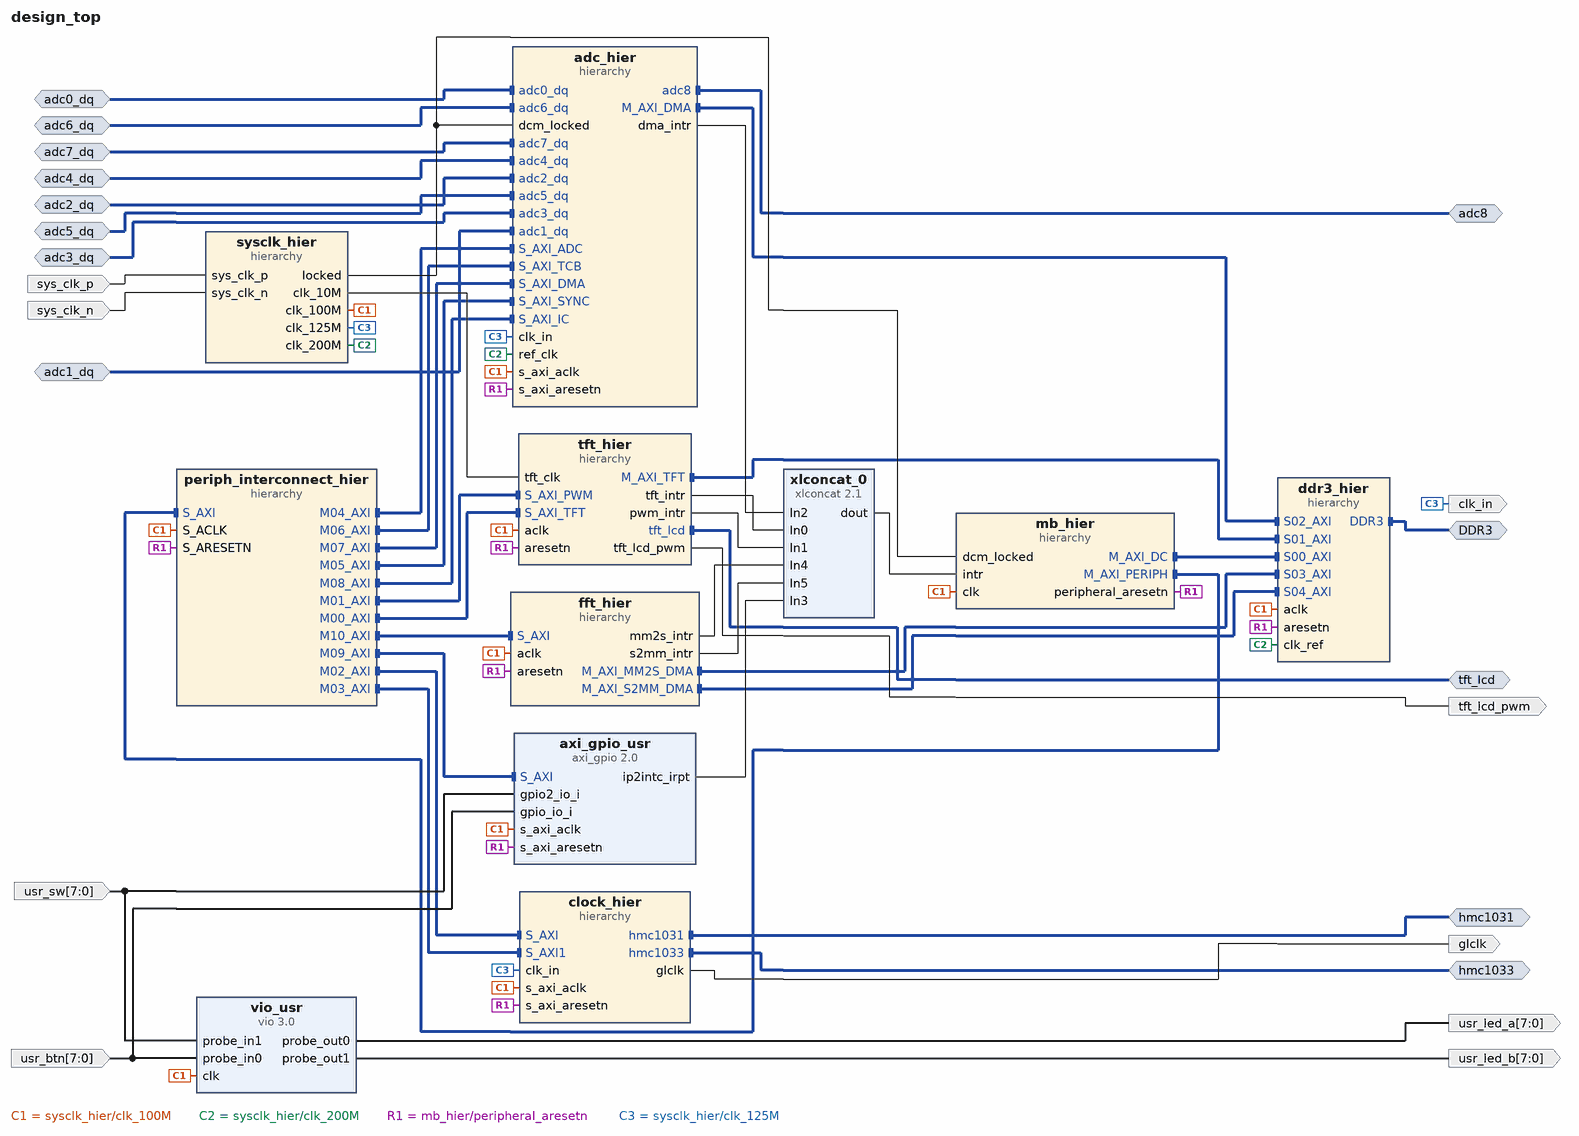
[diagram p0: block diagram of the top level]
# Vivado block design design_top, xc7a200tffg1156-2, Vivado 2018.3
create_bd_design design_top

create_bd_intf_port -mode Master -vlnv xilinx.com:interface:ddrx_rtl:1.0 DDR3
create_bd_intf_port -mode Master -vlnv xilinx.com:interface:vga_rtl:1.0 tft_lcd
create_bd_intf_port -mode Master -vlnv milandr.ru:interface:hmc1031_rtl:1.0 hmc1031
create_bd_intf_port -mode Master -vlnv milandr.ru:interface:hmc1033_io_rtl:1.0 hmc1033
create_bd_intf_port -mode Master -vlnv milandr.ru:interface:adc8_intf_rtl:1.0 adc8
create_bd_intf_port -mode Slave -vlnv milandr.ru:interface:adc8_dq_intf_rtl:1.0 adc0_dq
create_bd_intf_port -mode Slave -vlnv milandr.ru:interface:adc8_dq_intf_rtl:1.0 adc1_dq
create_bd_intf_port -mode Slave -vlnv milandr.ru:interface:adc8_dq_intf_rtl:1.0 adc2_dq
create_bd_intf_port -mode Slave -vlnv milandr.ru:interface:adc8_dq_intf_rtl:1.0 adc3_dq
create_bd_intf_port -mode Slave -vlnv milandr.ru:interface:adc8_dq_intf_rtl:1.0 adc4_dq
create_bd_intf_port -mode Slave -vlnv milandr.ru:interface:adc8_dq_intf_rtl:1.0 adc5_dq
create_bd_intf_port -mode Slave -vlnv milandr.ru:interface:adc8_dq_intf_rtl:1.0 adc6_dq
create_bd_intf_port -mode Slave -vlnv milandr.ru:interface:adc8_dq_intf_rtl:1.0 adc7_dq
create_bd_port -dir I -type clk sys_clk_p
set_property -dict {CONFIG.FREQ_HZ 125000000} [get_bd_ports sys_clk_p]
create_bd_port -dir I -type clk sys_clk_n
set_property -dict {CONFIG.FREQ_HZ 125000000} [get_bd_ports sys_clk_n]
create_bd_port -dir O tft_lcd_pwm
create_bd_port -dir I -from 7 -to 0 usr_btn
create_bd_port -dir I -from 7 -to 0 usr_sw
create_bd_port -dir O -type clk glclk
set_property -dict {CONFIG.FREQ_HZ 5000000} [get_bd_ports glclk]
create_bd_port -dir O clk_in
create_bd_port -dir O -from 7 -to 0 usr_led_a
create_bd_port -dir O -from 7 -to 0 usr_led_b

create_bd_cell -type hier ddr3_hier
create_bd_cell -type hier mb_hier
create_bd_cell -type hier sysclk_hier
create_bd_cell -type ip -vlnv xilinx.com:ip:xlconcat:2.1 xlconcat_0
set_property -dict {CONFIG.NUM_PORTS 6} [get_bd_cells xlconcat_0]
create_bd_cell -type hier periph_interconnect_hier
create_bd_cell -type hier tft_hier
create_bd_cell -type ip -vlnv xilinx.com:ip:vio:3.0 vio_usr
set_property -dict [list \
  CONFIG.C_NUM_PROBE_IN 2 \
  CONFIG.C_NUM_PROBE_OUT 2 \
  CONFIG.C_PROBE_OUT0_INIT_VAL 0xFF \
  CONFIG.C_PROBE_OUT0_WIDTH 8 \
  CONFIG.C_PROBE_OUT1_INIT_VAL 0xFF \
  CONFIG.C_PROBE_OUT1_WIDTH 8 \
] [get_bd_cells vio_usr]
create_bd_cell -type hier clock_hier
create_bd_cell -type hier adc_hier
create_bd_cell -type ip -vlnv xilinx.com:ip:axi_gpio:2.0 axi_gpio_usr
set_property -dict [list \
  CONFIG.C_ALL_INPUTS 1 \
  CONFIG.C_ALL_INPUTS_2 1 \
  CONFIG.C_GPIO2_WIDTH 8 \
  CONFIG.C_GPIO_WIDTH 8 \
  CONFIG.C_INTERRUPT_PRESENT 1 \
  CONFIG.C_IS_DUAL 1 \
] [get_bd_cells axi_gpio_usr]
create_bd_cell -type hier fft_hier

# ---- hierarchy /ddr3_hier ----
current_bd_instance /ddr3_hier
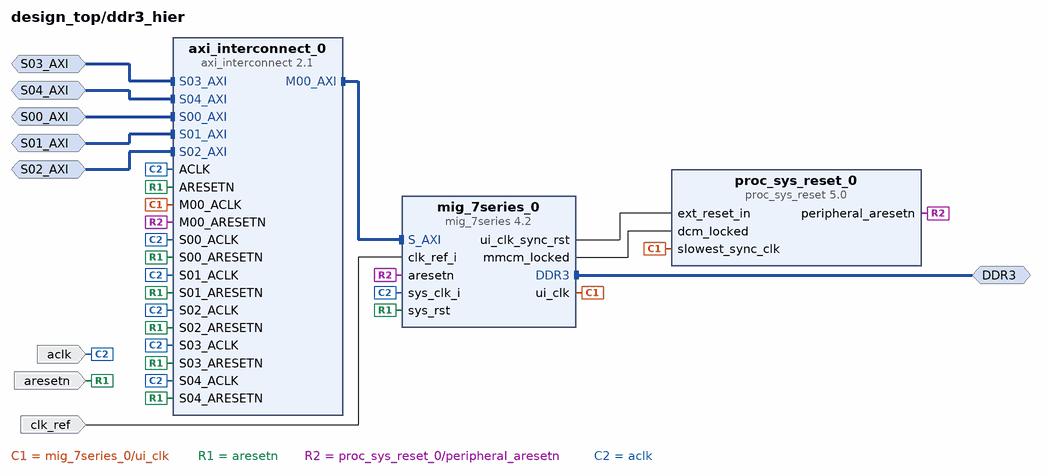
[diagram p1: block diagram inside /ddr3_hier]
create_bd_intf_pin -mode Master -vlnv xilinx.com:interface:ddrx_rtl:1.0 DDR3
create_bd_intf_pin -mode Slave -vlnv xilinx.com:interface:aximm_rtl:1.0 S00_AXI
create_bd_intf_pin -mode Slave -vlnv xilinx.com:interface:aximm_rtl:1.0 S01_AXI
create_bd_intf_pin -mode Slave -vlnv xilinx.com:interface:aximm_rtl:1.0 S02_AXI
create_bd_intf_pin -mode Slave -vlnv xilinx.com:interface:aximm_rtl:1.0 S03_AXI
create_bd_intf_pin -mode Slave -vlnv xilinx.com:interface:aximm_rtl:1.0 S04_AXI
create_bd_pin -dir I -type clk clk_ref
create_bd_pin -dir I -type rst aresetn
create_bd_pin -dir I -type clk aclk

create_bd_cell -type ip -vlnv xilinx.com:ip:proc_sys_reset:5.0 proc_sys_reset_0
create_bd_cell -type ip -vlnv xilinx.com:ip:mig_7series:4.2 mig_7series_0
set_property -dict [list \
  CONFIG.BOARD_MIG_PARAM Custom \
  CONFIG.RESET_BOARD_INTERFACE Custom \
  CONFIG.XML_INPUT_FILE mig_b.prj \
] [get_bd_cells mig_7series_0]
create_bd_cell -type ip -vlnv xilinx.com:ip:axi_interconnect:2.1 axi_interconnect_0
set_property -dict [list \
  CONFIG.ENABLE_ADVANCED_OPTIONS 1 \
  CONFIG.M00_HAS_DATA_FIFO 2 \
  CONFIG.M00_HAS_REGSLICE 3 \
  CONFIG.NUM_MI 1 \
  CONFIG.NUM_SI 5 \
  CONFIG.S00_ARB_PRIORITY 1 \
  CONFIG.S00_HAS_DATA_FIFO 2 \
  CONFIG.S00_HAS_REGSLICE 3 \
  CONFIG.S01_ARB_PRIORITY 2 \
  CONFIG.S01_HAS_DATA_FIFO 2 \
  CONFIG.S01_HAS_REGSLICE 3 \
  CONFIG.S02_HAS_DATA_FIFO 2 \
  CONFIG.S02_HAS_REGSLICE 3 \
  CONFIG.S03_HAS_DATA_FIFO 2 \
  CONFIG.S04_HAS_DATA_FIFO 2 \
  CONFIG.STRATEGY 2 \
] [get_bd_cells axi_interconnect_0]

# ---- hierarchy /mb_hier ----
current_bd_instance /mb_hier
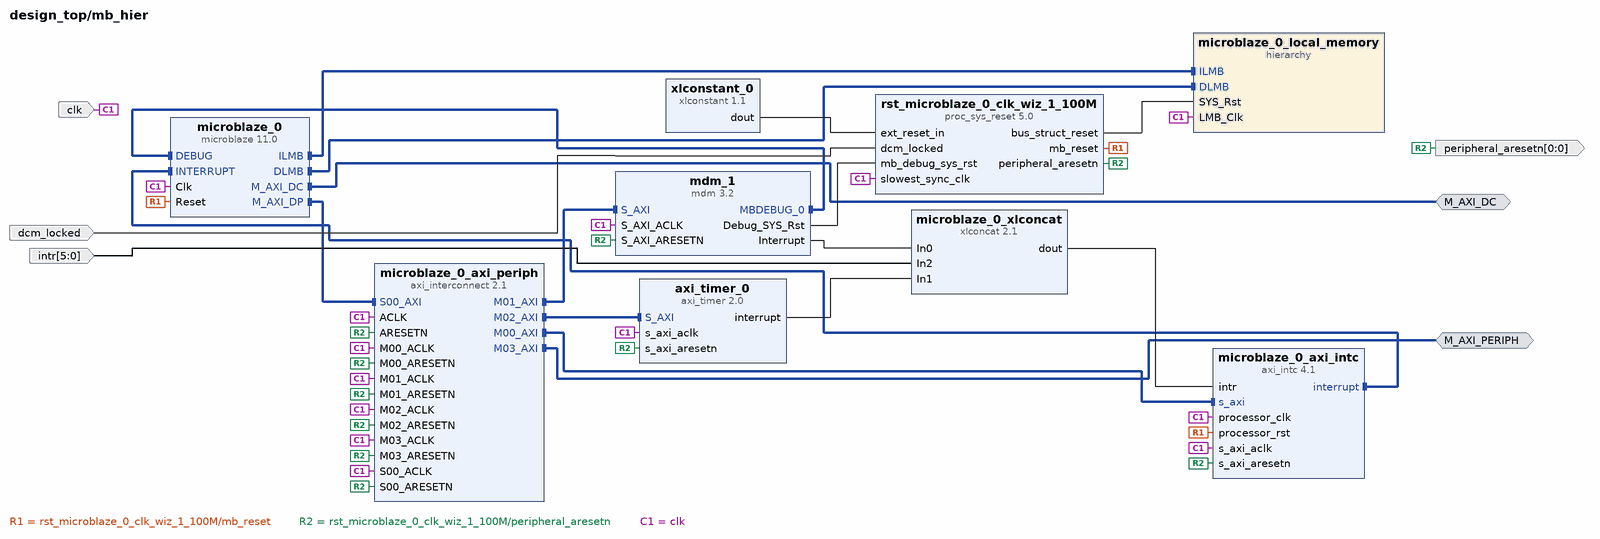
[diagram p2: block diagram inside /mb_hier]
create_bd_intf_pin -mode Master -vlnv xilinx.com:interface:aximm_rtl:1.0 M_AXI_DC
create_bd_intf_pin -mode Master -vlnv xilinx.com:interface:aximm_rtl:1.0 M_AXI_PERIPH
create_bd_pin -dir I -type clk clk
create_bd_pin -dir I dcm_locked
create_bd_pin -dir O -from 0 -to 0 -type rst peripheral_aresetn
create_bd_pin -dir I -from 5 -to 0 intr

create_bd_cell -type ip -vlnv xilinx.com:ip:proc_sys_reset:5.0 rst_microblaze_0_clk_wiz_1_100M
create_bd_cell -type ip -vlnv xilinx.com:ip:mdm:3.2 mdm_1
set_property -dict {CONFIG.C_ADDR_SIZE 32 CONFIG.C_M_AXI_ADDR_WIDTH 32 CONFIG.C_USE_UART 1} [get_bd_cells mdm_1]
create_bd_cell -type ip -vlnv xilinx.com:ip:xlconcat:2.1 microblaze_0_xlconcat
set_property -dict {CONFIG.NUM_PORTS 3} [get_bd_cells microblaze_0_xlconcat]
create_bd_cell -type ip -vlnv xilinx.com:ip:microblaze:11.0 microblaze_0
set_property -dict [list \
  CONFIG.C_ADDR_TAG_BITS 0 \
  CONFIG.C_BRANCH_TARGET_CACHE_SIZE 0 \
  CONFIG.C_DCACHE_BYTE_SIZE 8192 \
  CONFIG.C_DEBUG_ENABLED 1 \
  CONFIG.C_D_AXI 1 \
  CONFIG.C_D_LMB 1 \
  CONFIG.C_I_LMB 1 \
  CONFIG.C_USE_BARREL 1 \
  CONFIG.C_USE_BRANCH_TARGET_CACHE 1 \
  CONFIG.C_USE_DCACHE 1 \
  CONFIG.C_USE_DIV 1 \
  CONFIG.C_USE_FPU 2 \
  CONFIG.C_USE_HW_MUL 1 \
  CONFIG.C_USE_ICACHE 0 \
  CONFIG.C_USE_MSR_INSTR 1 \
  CONFIG.C_USE_PCMP_INSTR 1 \
] [get_bd_cells microblaze_0]
create_bd_cell -type ip -vlnv xilinx.com:ip:axi_intc:4.1 microblaze_0_axi_intc
set_property -dict {CONFIG.C_HAS_FAST 1} [get_bd_cells microblaze_0_axi_intc]
create_bd_cell -type ip -vlnv xilinx.com:ip:axi_interconnect:2.1 microblaze_0_axi_periph
set_property -dict {CONFIG.NUM_MI 4} [get_bd_cells microblaze_0_axi_periph]
create_bd_cell -type hier microblaze_0_local_memory
create_bd_cell -type ip -vlnv xilinx.com:ip:axi_timer:2.0 axi_timer_0
create_bd_cell -type ip -vlnv xilinx.com:ip:xlconstant:1.1 xlconstant_0

# ---- hierarchy /mb_hier/microblaze_0_local_memory ----
current_bd_instance /mb_hier/microblaze_0_local_memory
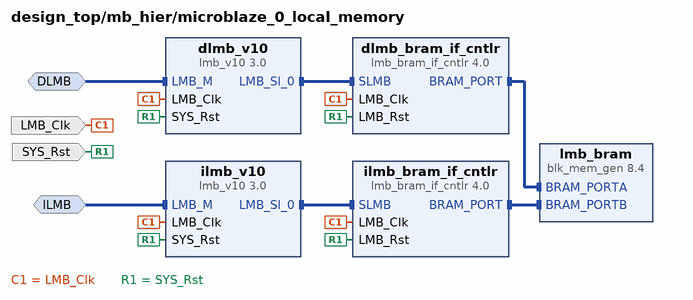
[diagram p3: block diagram inside /mb_hier/microblaze_0_local_memory]
create_bd_intf_pin -mode MirroredMaster -vlnv xilinx.com:interface:lmb_rtl:1.0 DLMB
create_bd_intf_pin -mode MirroredMaster -vlnv xilinx.com:interface:lmb_rtl:1.0 ILMB
create_bd_pin -dir I -type clk LMB_Clk
create_bd_pin -dir I -type rst SYS_Rst

create_bd_cell -type ip -vlnv xilinx.com:ip:lmb_v10:3.0 dlmb_v10
create_bd_cell -type ip -vlnv xilinx.com:ip:lmb_v10:3.0 ilmb_v10
create_bd_cell -type ip -vlnv xilinx.com:ip:lmb_bram_if_cntlr:4.0 dlmb_bram_if_cntlr
set_property -dict {CONFIG.C_ECC 0} [get_bd_cells dlmb_bram_if_cntlr]
create_bd_cell -type ip -vlnv xilinx.com:ip:lmb_bram_if_cntlr:4.0 ilmb_bram_if_cntlr
set_property -dict {CONFIG.C_ECC 0} [get_bd_cells ilmb_bram_if_cntlr]
create_bd_cell -type ip -vlnv xilinx.com:ip:blk_mem_gen:8.4 lmb_bram
set_property -dict {CONFIG.Memory_Type True_Dual_Port_RAM CONFIG.use_bram_block BRAM_Controller} [get_bd_cells lmb_bram]

# ---- hierarchy /sysclk_hier ----
current_bd_instance /sysclk_hier
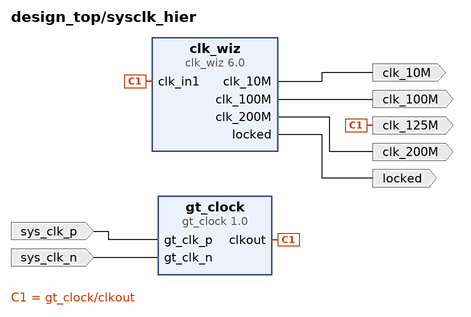
[diagram p4: block diagram inside /sysclk_hier]
create_bd_pin -dir I -type clk sys_clk_p
create_bd_pin -dir I -type clk sys_clk_n
create_bd_pin -dir O locked
create_bd_pin -dir O -type clk clk_100M
create_bd_pin -dir O -type clk clk_200M
create_bd_pin -dir O -type clk clk_10M
create_bd_pin -dir O clk_125M

create_bd_cell -type ip -vlnv milandr.ru:ip:gt_clock:1.0 gt_clock
create_bd_cell -type ip -vlnv xilinx.com:ip:clk_wiz:6.0 clk_wiz
set_property -dict [list \
  CONFIG.CLKIN1_JITTER_PS 80.0 \
  CONFIG.CLKOUT1_JITTER 124.615 \
  CONFIG.CLKOUT1_PHASE_ERROR 96.948 \
  CONFIG.CLKOUT2_JITTER 109.241 \
  CONFIG.CLKOUT2_PHASE_ERROR 96.948 \
  CONFIG.CLKOUT2_REQUESTED_OUT_FREQ 200.000 \
  CONFIG.CLKOUT2_USED true \
  CONFIG.CLKOUT3_JITTER 197.700 \
  CONFIG.CLKOUT3_PHASE_ERROR 96.948 \
  CONFIG.CLKOUT3_REQUESTED_OUT_FREQ 10.000 \
  CONFIG.CLKOUT3_USED true \
  CONFIG.CLKOUT4_JITTER 124.615 \
  CONFIG.CLKOUT4_PHASE_ERROR 96.948 \
  CONFIG.CLKOUT4_REQUESTED_OUT_FREQ 25.000 \
  CONFIG.CLKOUT4_USED false \
  CONFIG.CLK_OUT1_PORT clk_100M \
  CONFIG.CLK_OUT2_PORT clk_200M \
  CONFIG.CLK_OUT3_PORT clk_10M \
  CONFIG.CLK_OUT4_PORT clk_25M \
  CONFIG.MMCM_CLKFBOUT_MULT_F 8.000 \
  CONFIG.MMCM_CLKIN1_PERIOD 8.000 \
  CONFIG.MMCM_CLKOUT0_DIVIDE_F 10.000 \
  CONFIG.MMCM_CLKOUT1_DIVIDE 5 \
  CONFIG.MMCM_CLKOUT2_DIVIDE 100 \
  CONFIG.MMCM_CLKOUT3_DIVIDE 1 \
  CONFIG.MMCM_DIVCLK_DIVIDE 1 \
  CONFIG.NUM_OUT_CLKS 3 \
  CONFIG.PRIM_IN_FREQ 125 \
  CONFIG.PRIM_SOURCE Global_buffer \
  CONFIG.USE_RESET false \
] [get_bd_cells clk_wiz]

# ---- hierarchy /periph_interconnect_hier ----
current_bd_instance /periph_interconnect_hier
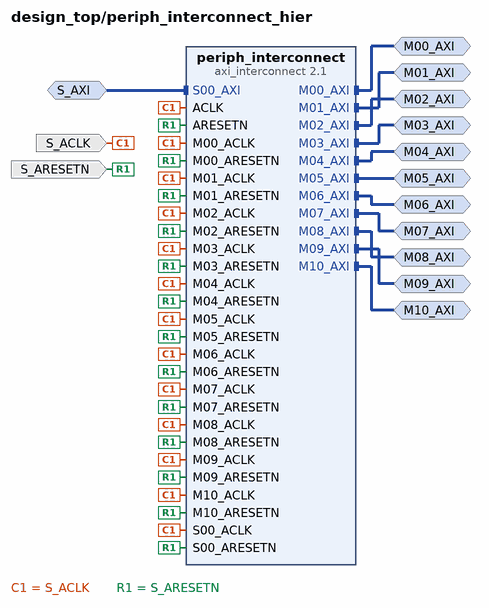
[diagram p5: block diagram inside /periph_interconnect_hier]
create_bd_intf_pin -mode Slave -vlnv xilinx.com:interface:aximm_rtl:1.0 S_AXI
create_bd_intf_pin -mode Master -vlnv xilinx.com:interface:aximm_rtl:1.0 M00_AXI
create_bd_intf_pin -mode Master -vlnv xilinx.com:interface:aximm_rtl:1.0 M01_AXI
create_bd_intf_pin -mode Master -vlnv xilinx.com:interface:aximm_rtl:1.0 M02_AXI
create_bd_intf_pin -mode Master -vlnv xilinx.com:interface:aximm_rtl:1.0 M03_AXI
create_bd_intf_pin -mode Master -vlnv xilinx.com:interface:aximm_rtl:1.0 M04_AXI
create_bd_intf_pin -mode Master -vlnv xilinx.com:interface:aximm_rtl:1.0 M05_AXI
create_bd_intf_pin -mode Master -vlnv xilinx.com:interface:aximm_rtl:1.0 M06_AXI
create_bd_intf_pin -mode Master -vlnv xilinx.com:interface:aximm_rtl:1.0 M07_AXI
create_bd_intf_pin -mode Master -vlnv xilinx.com:interface:aximm_rtl:1.0 M08_AXI
create_bd_intf_pin -mode Master -vlnv xilinx.com:interface:aximm_rtl:1.0 M09_AXI
create_bd_intf_pin -mode Master -vlnv xilinx.com:interface:aximm_rtl:1.0 M10_AXI
create_bd_pin -dir I -type clk S_ACLK
create_bd_pin -dir I -type rst S_ARESETN

create_bd_cell -type ip -vlnv xilinx.com:ip:axi_interconnect:2.1 periph_interconnect
set_property -dict {CONFIG.NUM_MI 11} [get_bd_cells periph_interconnect]

# ---- hierarchy /tft_hier ----
current_bd_instance /tft_hier
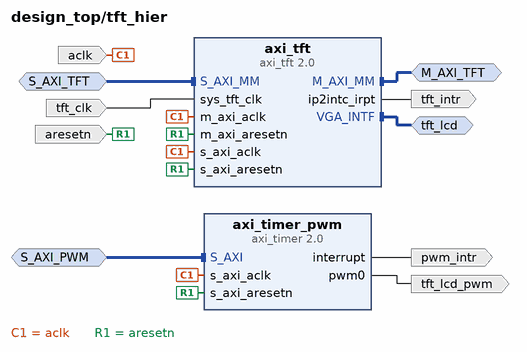
[diagram p6: block diagram inside /tft_hier]
create_bd_intf_pin -mode Slave -vlnv xilinx.com:interface:aximm_rtl:1.0 S_AXI_TFT
create_bd_intf_pin -mode Master -vlnv xilinx.com:interface:aximm_rtl:1.0 M_AXI_TFT
create_bd_intf_pin -mode Master -vlnv xilinx.com:interface:vga_rtl:1.0 tft_lcd
create_bd_intf_pin -mode Slave -vlnv xilinx.com:interface:aximm_rtl:1.0 S_AXI_PWM
create_bd_pin -dir I -type clk aclk
create_bd_pin -dir I -type rst aresetn
create_bd_pin -dir O -type intr tft_intr
create_bd_pin -dir I -type clk tft_clk
create_bd_pin -dir O tft_lcd_pwm
create_bd_pin -dir O -type intr pwm_intr

create_bd_cell -type ip -vlnv xilinx.com:ip:axi_tft:2.0 axi_tft
set_property -dict {CONFIG.C_EN_I2C_INTF 0 CONFIG.C_M_AXI_DATA_WIDTH 32 CONFIG.C_TFT_INTERFACE 0} [get_bd_cells axi_tft]
create_bd_cell -type ip -vlnv xilinx.com:ip:axi_timer:2.0 axi_timer_pwm

# ---- hierarchy /clock_hier ----
current_bd_instance /clock_hier
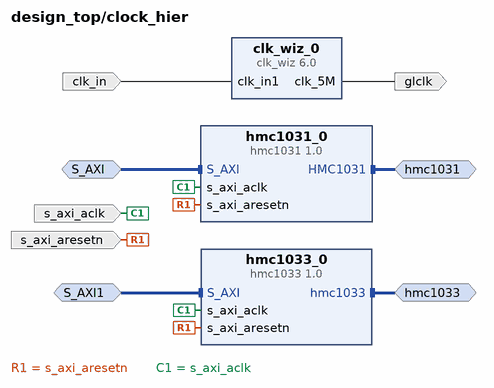
[diagram p7: block diagram inside /clock_hier]
create_bd_intf_pin -mode Slave -vlnv xilinx.com:interface:aximm_rtl:1.0 S_AXI
create_bd_intf_pin -mode Master -vlnv milandr.ru:interface:hmc1031_rtl:1.0 hmc1031
create_bd_intf_pin -mode Slave -vlnv xilinx.com:interface:aximm_rtl:1.0 S_AXI1
create_bd_intf_pin -mode Master -vlnv milandr.ru:interface:hmc1033_io_rtl:1.0 hmc1033
create_bd_pin -dir I -type clk s_axi_aclk
create_bd_pin -dir I -type rst s_axi_aresetn
create_bd_pin -dir O -type clk glclk
create_bd_pin -dir I -type clk clk_in

create_bd_cell -type ip -vlnv milandr.ru:ip:hmc1031:1.0 hmc1031_0
create_bd_cell -type ip -vlnv xilinx.com:ip:clk_wiz:6.0 clk_wiz_0
set_property -dict [list \
  CONFIG.CLKIN1_JITTER_PS 80.0 \
  CONFIG.CLKOUT1_JITTER 229.502 \
  CONFIG.CLKOUT1_PHASE_ERROR 115.818 \
  CONFIG.CLKOUT1_REQUESTED_OUT_FREQ 5.000 \
  CONFIG.CLK_OUT1_PORT clk_5M \
  CONFIG.JITTER_SEL Min_O_Jitter \
  CONFIG.MMCM_BANDWIDTH HIGH \
  CONFIG.MMCM_CLKFBOUT_MULT_F 4.875 \
  CONFIG.MMCM_CLKIN1_PERIOD 8.000 \
  CONFIG.MMCM_CLKIN2_PERIOD 10.0 \
  CONFIG.MMCM_CLKOUT0_DIVIDE_F 121.875 \
  CONFIG.MMCM_DIVCLK_DIVIDE 1 \
  CONFIG.PRIM_IN_FREQ 125.000 \
  CONFIG.PRIM_SOURCE Global_buffer \
  CONFIG.USE_LOCKED false \
  CONFIG.USE_RESET false \
] [get_bd_cells clk_wiz_0]
create_bd_cell -type ip -vlnv milandr.ru:ip:hmc1033:1.0 hmc1033_0

# ---- hierarchy /adc_hier ----
current_bd_instance /adc_hier
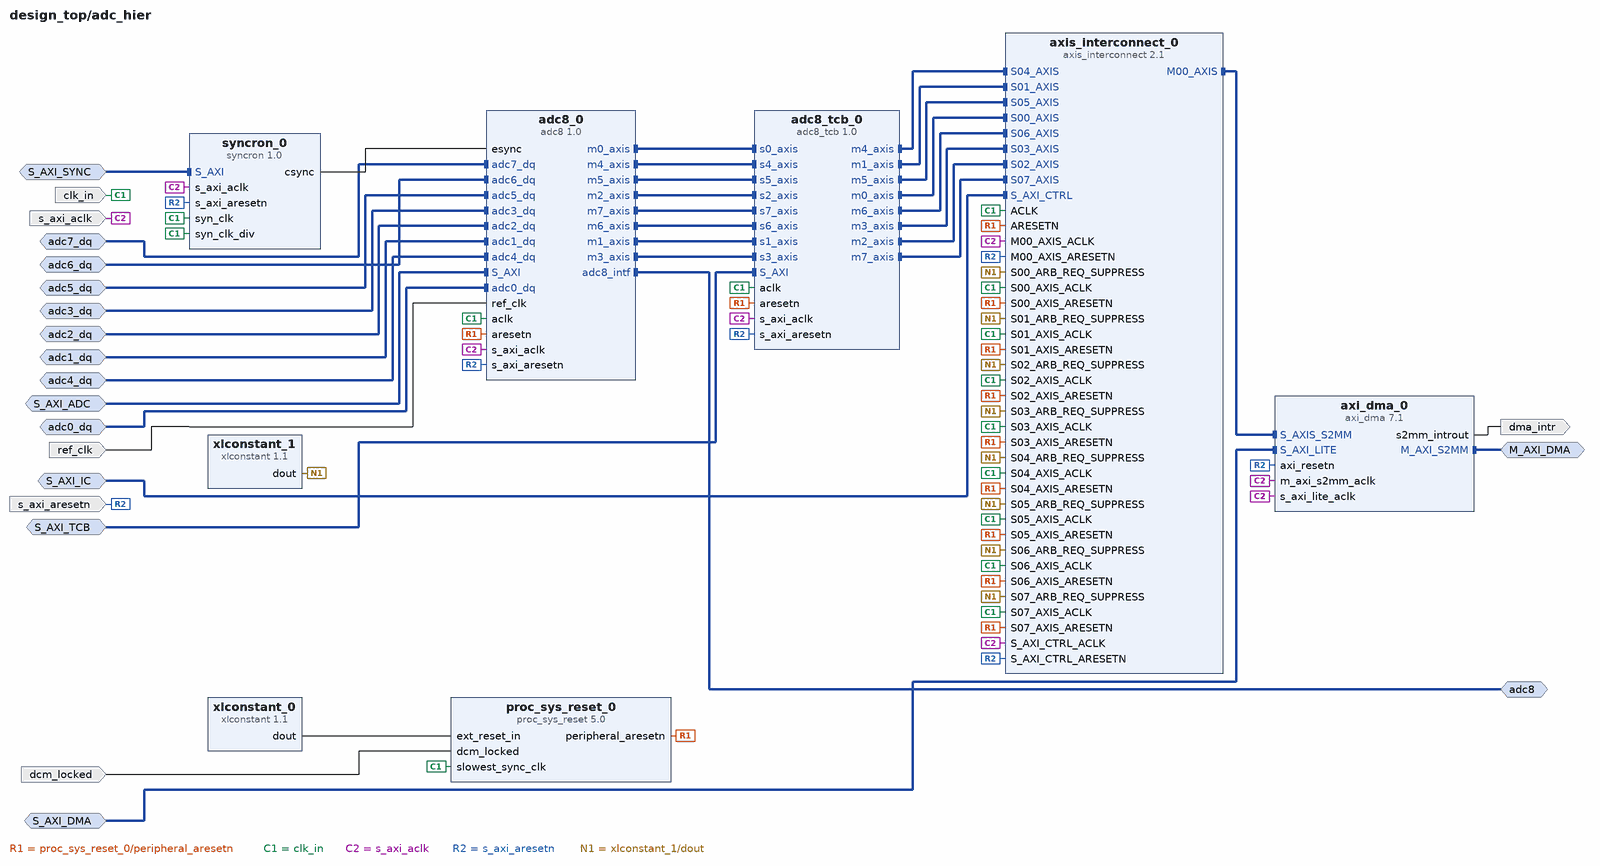
[diagram p8: block diagram inside /adc_hier]
create_bd_intf_pin -mode Slave -vlnv xilinx.com:interface:aximm_rtl:1.0 S_AXI_SYNC
create_bd_intf_pin -mode Slave -vlnv xilinx.com:interface:aximm_rtl:1.0 S_AXI_ADC
create_bd_intf_pin -mode Master -vlnv milandr.ru:interface:adc8_intf_rtl:1.0 adc8
create_bd_intf_pin -mode Slave -vlnv milandr.ru:interface:adc8_dq_intf_rtl:1.0 adc0_dq
create_bd_intf_pin -mode Slave -vlnv milandr.ru:interface:adc8_dq_intf_rtl:1.0 adc1_dq
create_bd_intf_pin -mode Slave -vlnv milandr.ru:interface:adc8_dq_intf_rtl:1.0 adc2_dq
create_bd_intf_pin -mode Slave -vlnv milandr.ru:interface:adc8_dq_intf_rtl:1.0 adc3_dq
create_bd_intf_pin -mode Slave -vlnv milandr.ru:interface:adc8_dq_intf_rtl:1.0 adc4_dq
create_bd_intf_pin -mode Slave -vlnv milandr.ru:interface:adc8_dq_intf_rtl:1.0 adc5_dq
create_bd_intf_pin -mode Slave -vlnv milandr.ru:interface:adc8_dq_intf_rtl:1.0 adc6_dq
create_bd_intf_pin -mode Slave -vlnv milandr.ru:interface:adc8_dq_intf_rtl:1.0 adc7_dq
create_bd_intf_pin -mode Slave -vlnv xilinx.com:interface:aximm_rtl:1.0 S_AXI_TCB
create_bd_intf_pin -mode Slave -vlnv xilinx.com:interface:aximm_rtl:1.0 S_AXI_DMA
create_bd_intf_pin -mode Master -vlnv xilinx.com:interface:aximm_rtl:1.0 M_AXI_DMA
create_bd_intf_pin -mode Slave -vlnv xilinx.com:interface:aximm_rtl:1.0 S_AXI_IC
create_bd_pin -dir I -type clk clk_in
create_bd_pin -dir I -type clk s_axi_aclk
create_bd_pin -dir I -type rst s_axi_aresetn
create_bd_pin -dir I -type clk ref_clk
create_bd_pin -dir I dcm_locked
create_bd_pin -dir O -type intr dma_intr

create_bd_cell -type ip -vlnv milandr.ru:ip:syncron:1.0 syncron_0
set_property -dict [list \
  CONFIG.SYNC_CAP_DDC_DDELAY 250 \
  CONFIG.SYNC_CAP_DDC_DWIDTH 5 \
  CONFIG.SYNC_CAP_LNK_DWIDTH 5 \
  CONFIG.SYNC_CLK_WIDTH 5 \
  CONFIG.SYNC_LNK_CDELAY 0 \
  CONFIG.SYNC_LNK_CWIDTH 100 \
  CONFIG.SYNC_LNK_DWIDTH 5 \
] [get_bd_cells syncron_0]
create_bd_cell -type ip -vlnv xilinx.com:ip:xlconstant:1.1 xlconstant_0
create_bd_cell -type ip -vlnv xilinx.com:ip:proc_sys_reset:5.0 proc_sys_reset_0
create_bd_cell -type ip -vlnv xilinx.com:ip:axi_dma:7.1 axi_dma_0
set_property -dict [list \
  CONFIG.c_include_mm2s 0 \
  CONFIG.c_include_sg 0 \
  CONFIG.c_s2mm_burst_size 16 \
  CONFIG.c_sg_length_width 24 \
] [get_bd_cells axi_dma_0]
create_bd_cell -type ip -vlnv xilinx.com:ip:axis_interconnect:2.1 axis_interconnect_0
set_property -dict [list \
  CONFIG.ENABLE_ADVANCED_OPTIONS 0 \
  CONFIG.NUM_MI 1 \
  CONFIG.NUM_SI 8 \
  CONFIG.ROUTING_MODE 1 \
] [get_bd_cells axis_interconnect_0]
create_bd_cell -type ip -vlnv xilinx.com:ip:xlconstant:1.1 xlconstant_1
set_property -dict {CONFIG.CONST_VAL 0} [get_bd_cells xlconstant_1]
create_bd_cell -type ip -vlnv milandr.ru:ip:adc8_tcb:1.0 adc8_tcb_0
set_property -dict {CONFIG.FIFO_DEPTH 8192} [get_bd_cells adc8_tcb_0]
create_bd_cell -type ip -vlnv milandr.ru:ip:adc8:1.0 adc8_0
set_property -dict [list \
  CONFIG.DELAY_CTRL_ENABLE_0 1 \
  CONFIG.DELAY_CTRL_ENABLE_1 1 \
  CONFIG.DELAY_CTRL_ENABLE_4 1 \
  CONFIG.DELAY_CTRL_ENABLE_5 1 \
  CONFIG.DELAY_GROUP_0 ADC_IF_GROUP_A \
  CONFIG.DELAY_GROUP_1 ADC_IF_GROUP_B \
  CONFIG.DELAY_GROUP_2 ADC_IF_GROUP_B \
  CONFIG.DELAY_GROUP_3 ADC_IF_GROUP_A \
  CONFIG.DELAY_GROUP_4 ADC_IF_GROUP_C \
  CONFIG.DELAY_GROUP_5 ADC_IF_GROUP_D \
  CONFIG.DELAY_GROUP_6 ADC_IF_GROUP_D \
  CONFIG.DELAY_GROUP_7 ADC_IF_GROUP_C \
] [get_bd_cells adc8_0]

# ---- hierarchy /fft_hier ----
current_bd_instance /fft_hier
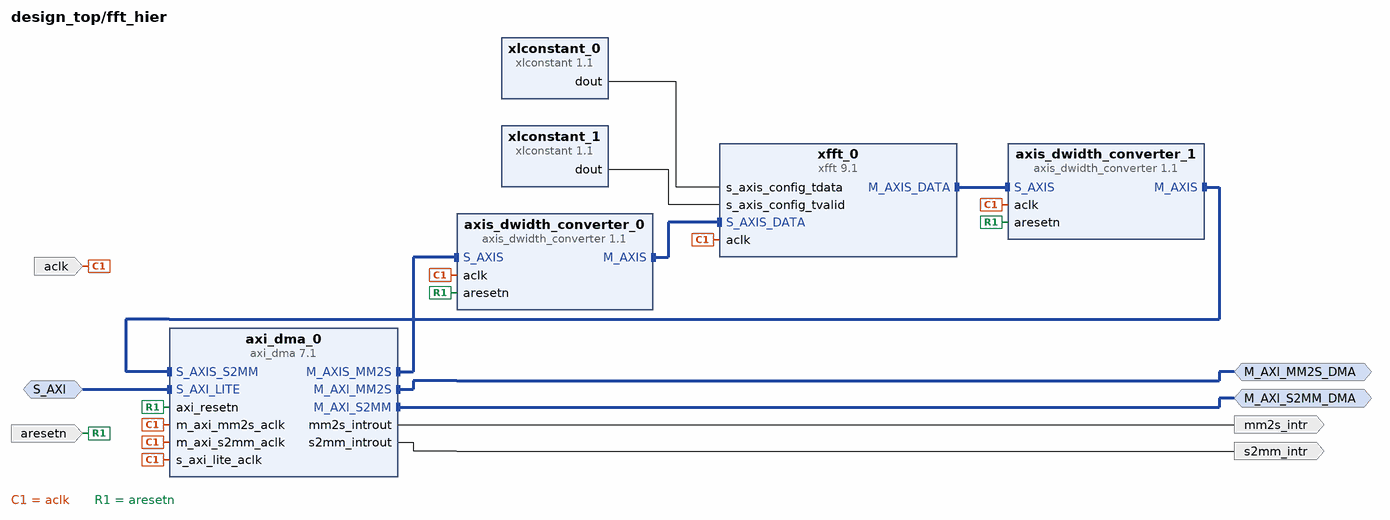
[diagram p9: block diagram inside /fft_hier]
create_bd_intf_pin -mode Slave -vlnv xilinx.com:interface:aximm_rtl:1.0 S_AXI
create_bd_intf_pin -mode Master -vlnv xilinx.com:interface:aximm_rtl:1.0 M_AXI_MM2S_DMA
create_bd_intf_pin -mode Master -vlnv xilinx.com:interface:aximm_rtl:1.0 M_AXI_S2MM_DMA
create_bd_pin -dir I -type clk aclk
create_bd_pin -dir I -type rst aresetn
create_bd_pin -dir O -type intr mm2s_intr
create_bd_pin -dir O -type intr s2mm_intr

create_bd_cell -type ip -vlnv xilinx.com:ip:axi_dma:7.1 axi_dma_0
set_property -dict {CONFIG.c_include_sg 0 CONFIG.c_sg_length_width 24} [get_bd_cells axi_dma_0]
create_bd_cell -type ip -vlnv xilinx.com:ip:xlconstant:1.1 xlconstant_0
set_property -dict {CONFIG.CONST_WIDTH 16} [get_bd_cells xlconstant_0]
create_bd_cell -type ip -vlnv xilinx.com:ip:xlconstant:1.1 xlconstant_1
create_bd_cell -type ip -vlnv xilinx.com:ip:axis_dwidth_converter:1.1 axis_dwidth_converter_0
set_property -dict [list \
  CONFIG.HAS_MI_TKEEP 1 \
  CONFIG.HAS_TKEEP 0 \
  CONFIG.HAS_TLAST 1 \
  CONFIG.HAS_TSTRB 0 \
  CONFIG.M_TDATA_NUM_BYTES 8 \
  CONFIG.S_TDATA_NUM_BYTES 4 \
  CONFIG.TDEST_WIDTH 0 \
  CONFIG.TID_WIDTH 0 \
  CONFIG.TUSER_BITS_PER_BYTE 0 \
] [get_bd_cells axis_dwidth_converter_0]
create_bd_cell -type ip -vlnv xilinx.com:ip:axis_dwidth_converter:1.1 axis_dwidth_converter_1
set_property -dict [list \
  CONFIG.HAS_MI_TKEEP 0 \
  CONFIG.HAS_TKEEP 0 \
  CONFIG.HAS_TLAST 1 \
  CONFIG.HAS_TSTRB 0 \
  CONFIG.M_TDATA_NUM_BYTES 4 \
  CONFIG.S_TDATA_NUM_BYTES 8 \
  CONFIG.TDEST_WIDTH 0 \
  CONFIG.TID_WIDTH 0 \
  CONFIG.TUSER_BITS_PER_BYTE 0 \
] [get_bd_cells axis_dwidth_converter_1]
create_bd_cell -type ip -vlnv xilinx.com:ip:xfft:9.1 xfft_0
set_property -dict [list \
  CONFIG.butterfly_type use_xtremedsp_slices \
  CONFIG.complex_mult_type use_mults_resources \
  CONFIG.data_format floating_point \
  CONFIG.implementation_options radix_4_burst_io \
  CONFIG.number_of_stages_using_block_ram_for_data_and_phase_factors 0 \
  CONFIG.output_ordering natural_order \
  CONFIG.phase_factor_width 24 \
  CONFIG.target_clock_frequency 100 \
  CONFIG.target_data_throughput 50 \
  CONFIG.transform_length 8192 \
] [get_bd_cells xfft_0]

# ---- connections ----

current_bd_instance /ddr3_hier
connect_bd_intf_net [get_bd_intf_pins S03_AXI] [get_bd_intf_pins axi_interconnect_0/S03_AXI]
connect_bd_intf_net [get_bd_intf_pins S04_AXI] [get_bd_intf_pins axi_interconnect_0/S04_AXI]
connect_bd_intf_net [get_bd_intf_pins DDR3] [get_bd_intf_pins mig_7series_0/DDR3]
connect_bd_intf_net [get_bd_intf_pins axi_interconnect_0/M00_AXI] [get_bd_intf_pins mig_7series_0/S_AXI]
connect_bd_intf_net [get_bd_intf_pins S00_AXI] [get_bd_intf_pins axi_interconnect_0/S00_AXI]
connect_bd_intf_net [get_bd_intf_pins S01_AXI] [get_bd_intf_pins axi_interconnect_0/S01_AXI]
connect_bd_intf_net [get_bd_intf_pins S02_AXI] [get_bd_intf_pins axi_interconnect_0/S02_AXI]
connect_bd_net [get_bd_pins mig_7series_0/ui_clk] [get_bd_pins proc_sys_reset_0/slowest_sync_clk] [get_bd_pins axi_interconnect_0/M00_ACLK]
connect_bd_net [get_bd_pins mig_7series_0/ui_clk_sync_rst] [get_bd_pins proc_sys_reset_0/ext_reset_in]
connect_bd_net [get_bd_pins mig_7series_0/mmcm_locked] [get_bd_pins proc_sys_reset_0/dcm_locked]
connect_bd_net -net clk_ref_i_0_1 [get_bd_pins clk_ref] [get_bd_pins mig_7series_0/clk_ref_i]
connect_bd_net -net sys_rst_0_1 [get_bd_pins aresetn] \
  [get_bd_pins mig_7series_0/sys_rst] [get_bd_pins axi_interconnect_0/ARESETN] [get_bd_pins axi_interconnect_0/S00_ARESETN] \
  [get_bd_pins axi_interconnect_0/S01_ARESETN] [get_bd_pins axi_interconnect_0/S02_ARESETN] \
  [get_bd_pins axi_interconnect_0/S03_ARESETN] [get_bd_pins axi_interconnect_0/S04_ARESETN]
connect_bd_net [get_bd_pins proc_sys_reset_0/peripheral_aresetn] [get_bd_pins mig_7series_0/aresetn] [get_bd_pins axi_interconnect_0/M00_ARESETN]
connect_bd_net -net sys_clk_i_0_1 [get_bd_pins aclk] \
  [get_bd_pins mig_7series_0/sys_clk_i] [get_bd_pins axi_interconnect_0/ACLK] [get_bd_pins axi_interconnect_0/S00_ACLK] \
  [get_bd_pins axi_interconnect_0/S01_ACLK] [get_bd_pins axi_interconnect_0/S02_ACLK] \
  [get_bd_pins axi_interconnect_0/S03_ACLK] [get_bd_pins axi_interconnect_0/S04_ACLK]

current_bd_instance /mb_hier
connect_bd_intf_net [get_bd_intf_pins mdm_1/MBDEBUG_0] [get_bd_intf_pins microblaze_0/DEBUG]
connect_bd_intf_net [get_bd_intf_pins microblaze_0/ILMB] [get_bd_intf_pins microblaze_0_local_memory/ILMB]
connect_bd_intf_net [get_bd_intf_pins microblaze_0/DLMB] [get_bd_intf_pins microblaze_0_local_memory/DLMB]
connect_bd_intf_net -intf_net microblaze_0_axi_dp [get_bd_intf_pins microblaze_0_axi_periph/S00_AXI] [get_bd_intf_pins microblaze_0/M_AXI_DP]
connect_bd_intf_net -intf_net microblaze_0_mdm_axi [get_bd_intf_pins microblaze_0_axi_periph/M01_AXI] [get_bd_intf_pins mdm_1/S_AXI]
connect_bd_intf_net [get_bd_intf_pins microblaze_0_axi_intc/interrupt] [get_bd_intf_pins microblaze_0/INTERRUPT]
connect_bd_intf_net -intf_net microblaze_0_intc_axi [get_bd_intf_pins microblaze_0_axi_periph/M00_AXI] [get_bd_intf_pins microblaze_0_axi_intc/s_axi]
connect_bd_intf_net [get_bd_intf_pins M_AXI_DC] [get_bd_intf_pins microblaze_0/M_AXI_DC]
connect_bd_intf_net [get_bd_intf_pins microblaze_0_axi_periph/M02_AXI] [get_bd_intf_pins axi_timer_0/S_AXI]
connect_bd_intf_net [get_bd_intf_pins M_AXI_PERIPH] [get_bd_intf_pins microblaze_0_axi_periph/M03_AXI]
connect_bd_net [get_bd_pins mdm_1/Debug_SYS_Rst] [get_bd_pins rst_microblaze_0_clk_wiz_1_100M/mb_debug_sys_rst]
connect_bd_net [get_bd_pins rst_microblaze_0_clk_wiz_1_100M/mb_reset] \
  [get_bd_pins microblaze_0/Reset] [get_bd_pins microblaze_0_axi_intc/processor_rst]
connect_bd_net [get_bd_pins rst_microblaze_0_clk_wiz_1_100M/bus_struct_reset] [get_bd_pins microblaze_0_local_memory/SYS_Rst]
connect_bd_net [get_bd_pins rst_microblaze_0_clk_wiz_1_100M/peripheral_aresetn] \
  [get_bd_pins microblaze_0_axi_periph/ARESETN] [get_bd_pins microblaze_0_axi_periph/S00_ARESETN] \
  [get_bd_pins microblaze_0_axi_periph/M00_ARESETN] [get_bd_pins microblaze_0_axi_periph/M01_ARESETN] \
  [get_bd_pins mdm_1/S_AXI_ARESETN] [get_bd_pins microblaze_0_axi_intc/s_axi_aresetn] \
  [get_bd_pins microblaze_0_axi_periph/M02_ARESETN] [get_bd_pins peripheral_aresetn] [get_bd_pins axi_timer_0/s_axi_aresetn] \
  [get_bd_pins microblaze_0_axi_periph/M03_ARESETN]
connect_bd_net -net microblaze_0_intr [get_bd_pins microblaze_0_xlconcat/dout] [get_bd_pins microblaze_0_axi_intc/intr]
connect_bd_net -net microblaze_0_Clk [get_bd_pins clk] \
  [get_bd_pins microblaze_0/Clk] [get_bd_pins microblaze_0_axi_periph/ACLK] [get_bd_pins microblaze_0_axi_periph/S00_ACLK] \
  [get_bd_pins microblaze_0_axi_periph/M00_ACLK] [get_bd_pins microblaze_0_axi_periph/M01_ACLK] \
  [get_bd_pins microblaze_0_axi_intc/s_axi_aclk] [get_bd_pins microblaze_0_axi_intc/processor_clk] \
  [get_bd_pins microblaze_0_local_memory/LMB_Clk] [get_bd_pins mdm_1/S_AXI_ACLK] \
  [get_bd_pins rst_microblaze_0_clk_wiz_1_100M/slowest_sync_clk] [get_bd_pins microblaze_0_axi_periph/M02_ACLK] \
  [get_bd_pins axi_timer_0/s_axi_aclk] [get_bd_pins microblaze_0_axi_periph/M03_ACLK]
connect_bd_net -net microblaze_0_clk_wiz_1_locked [get_bd_pins dcm_locked] [get_bd_pins rst_microblaze_0_clk_wiz_1_100M/dcm_locked]
connect_bd_net [get_bd_pins mdm_1/Interrupt] [get_bd_pins microblaze_0_xlconcat/In0]
connect_bd_net [get_bd_pins axi_timer_0/interrupt] [get_bd_pins microblaze_0_xlconcat/In1]
connect_bd_net -net In2_0_1 [get_bd_pins intr] [get_bd_pins microblaze_0_xlconcat/In2]
connect_bd_net [get_bd_pins xlconstant_0/dout] [get_bd_pins rst_microblaze_0_clk_wiz_1_100M/ext_reset_in]
set_property HDL_ATTRIBUTE.BMM_INFO_PROCESSOR {microblaze-le > design_top mb_hier/microblaze_0_local_memory/dlmb_bram_if_cntlr} [get_bd_cells microblaze_0]
set_property HDL_ATTRIBUTE.KEEP_HIERARCHY yes [get_bd_cells microblaze_0]

current_bd_instance /mb_hier/microblaze_0_local_memory
connect_bd_intf_net -intf_net microblaze_0_ilmb_cntlr [get_bd_intf_pins ilmb_bram_if_cntlr/BRAM_PORT] [get_bd_intf_pins lmb_bram/BRAM_PORTB]
connect_bd_intf_net -intf_net microblaze_0_dlmb [get_bd_intf_pins DLMB] [get_bd_intf_pins dlmb_v10/LMB_M]
connect_bd_intf_net -intf_net microblaze_0_ilmb [get_bd_intf_pins ILMB] [get_bd_intf_pins ilmb_v10/LMB_M]
connect_bd_intf_net -intf_net microblaze_0_dlmb_bus [get_bd_intf_pins dlmb_v10/LMB_Sl_0] [get_bd_intf_pins dlmb_bram_if_cntlr/SLMB]
connect_bd_intf_net -intf_net microblaze_0_ilmb_bus [get_bd_intf_pins ilmb_v10/LMB_Sl_0] [get_bd_intf_pins ilmb_bram_if_cntlr/SLMB]
connect_bd_intf_net -intf_net microblaze_0_dlmb_cntlr [get_bd_intf_pins dlmb_bram_if_cntlr/BRAM_PORT] [get_bd_intf_pins lmb_bram/BRAM_PORTA]
connect_bd_net -net microblaze_0_Clk [get_bd_pins LMB_Clk] \
  [get_bd_pins dlmb_v10/LMB_Clk] [get_bd_pins dlmb_bram_if_cntlr/LMB_Clk] [get_bd_pins ilmb_v10/LMB_Clk] \
  [get_bd_pins ilmb_bram_if_cntlr/LMB_Clk]
connect_bd_net [get_bd_pins SYS_Rst] \
  [get_bd_pins dlmb_v10/SYS_Rst] [get_bd_pins dlmb_bram_if_cntlr/LMB_Rst] [get_bd_pins ilmb_v10/SYS_Rst] \
  [get_bd_pins ilmb_bram_if_cntlr/LMB_Rst]
set_property HDL_ATTRIBUTE.BMM_INFO_ADDRESS_SPACE {byte  0x00000000 32 > design_top mb_hier/microblaze_0_local_memory/lmb_bram} [get_bd_cells dlmb_bram_if_cntlr]
set_property HDL_ATTRIBUTE.KEEP_HIERARCHY yes [get_bd_cells dlmb_bram_if_cntlr]

current_bd_instance /sysclk_hier
connect_bd_net -net gt_clock_0_clkout [get_bd_pins gt_clock/clkout] [get_bd_pins clk_wiz/clk_in1] [get_bd_pins clk_125M]
connect_bd_net [get_bd_pins sys_clk_p] [get_bd_pins gt_clock/gt_clk_p]
connect_bd_net [get_bd_pins sys_clk_n] [get_bd_pins gt_clock/gt_clk_n]
connect_bd_net -net microblaze_0_clk_wiz_1_locked [get_bd_pins clk_wiz/locked] [get_bd_pins locked]
connect_bd_net -net microblaze_0_Clk [get_bd_pins clk_wiz/clk_100M] [get_bd_pins clk_100M]
connect_bd_net -net clk_ref_1 [get_bd_pins clk_wiz/clk_200M] [get_bd_pins clk_200M]
connect_bd_net [get_bd_pins clk_wiz/clk_10M] [get_bd_pins clk_10M]

current_bd_instance /periph_interconnect_hier
connect_bd_intf_net [get_bd_intf_pins M01_AXI] [get_bd_intf_pins periph_interconnect/M01_AXI]
connect_bd_intf_net [get_bd_intf_pins M00_AXI] [get_bd_intf_pins periph_interconnect/M00_AXI]
connect_bd_intf_net -intf_net mb_hier_M_AXI_PERIPH [get_bd_intf_pins S_AXI] [get_bd_intf_pins periph_interconnect/S00_AXI]
connect_bd_intf_net [get_bd_intf_pins M04_AXI] [get_bd_intf_pins periph_interconnect/M04_AXI]
connect_bd_intf_net [get_bd_intf_pins M03_AXI] [get_bd_intf_pins periph_interconnect/M03_AXI]
connect_bd_intf_net [get_bd_intf_pins M09_AXI] [get_bd_intf_pins periph_interconnect/M09_AXI]
connect_bd_intf_net [get_bd_intf_pins M10_AXI] [get_bd_intf_pins periph_interconnect/M10_AXI]
connect_bd_intf_net [get_bd_intf_pins M02_AXI] [get_bd_intf_pins periph_interconnect/M02_AXI]
connect_bd_intf_net [get_bd_intf_pins M05_AXI] [get_bd_intf_pins periph_interconnect/M05_AXI]
connect_bd_intf_net [get_bd_intf_pins M08_AXI] [get_bd_intf_pins periph_interconnect/M08_AXI]
connect_bd_intf_net [get_bd_intf_pins M06_AXI] [get_bd_intf_pins periph_interconnect/M06_AXI]
connect_bd_intf_net [get_bd_intf_pins M07_AXI] [get_bd_intf_pins periph_interconnect/M07_AXI]
connect_bd_net -net microblaze_0_Clk [get_bd_pins S_ACLK] \
  [get_bd_pins periph_interconnect/S00_ACLK] [get_bd_pins periph_interconnect/M00_ACLK] \
  [get_bd_pins periph_interconnect/M01_ACLK] [get_bd_pins periph_interconnect/ACLK] \
  [get_bd_pins periph_interconnect/M02_ACLK] [get_bd_pins periph_interconnect/M03_ACLK] \
  [get_bd_pins periph_interconnect/M04_ACLK] [get_bd_pins periph_interconnect/M05_ACLK] \
  [get_bd_pins periph_interconnect/M06_ACLK] [get_bd_pins periph_interconnect/M07_ACLK] \
  [get_bd_pins periph_interconnect/M08_ACLK] [get_bd_pins periph_interconnect/M09_ACLK] \
  [get_bd_pins periph_interconnect/M10_ACLK]
connect_bd_net -net mb_hier_peripheral_aresetn [get_bd_pins S_ARESETN] \
  [get_bd_pins periph_interconnect/S00_ARESETN] [get_bd_pins periph_interconnect/M00_ARESETN] \
  [get_bd_pins periph_interconnect/M01_ARESETN] [get_bd_pins periph_interconnect/ARESETN] \
  [get_bd_pins periph_interconnect/M02_ARESETN] [get_bd_pins periph_interconnect/M03_ARESETN] \
  [get_bd_pins periph_interconnect/M04_ARESETN] [get_bd_pins periph_interconnect/M05_ARESETN] \
  [get_bd_pins periph_interconnect/M06_ARESETN] [get_bd_pins periph_interconnect/M07_ARESETN] \
  [get_bd_pins periph_interconnect/M08_ARESETN] [get_bd_pins periph_interconnect/M09_ARESETN] \
  [get_bd_pins periph_interconnect/M10_ARESETN]

current_bd_instance /tft_hier
connect_bd_intf_net -intf_net periph_interconnect_M00_AXI [get_bd_intf_pins S_AXI_TFT] [get_bd_intf_pins axi_tft/S_AXI_MM]
connect_bd_intf_net [get_bd_intf_pins M_AXI_TFT] [get_bd_intf_pins axi_tft/M_AXI_MM]
connect_bd_intf_net [get_bd_intf_pins tft_lcd] [get_bd_intf_pins axi_tft/VGA_INTF]
connect_bd_intf_net -intf_net periph_interconnect_M01_AXI [get_bd_intf_pins S_AXI_PWM] [get_bd_intf_pins axi_timer_pwm/S_AXI]
connect_bd_net -net microblaze_0_Clk [get_bd_pins aclk] \
  [get_bd_pins axi_tft/m_axi_aclk] [get_bd_pins axi_timer_pwm/s_axi_aclk] [get_bd_pins axi_tft/s_axi_aclk]
connect_bd_net -net mb_hier_peripheral_aresetn [get_bd_pins aresetn] \
  [get_bd_pins axi_tft/m_axi_aresetn] [get_bd_pins axi_timer_pwm/s_axi_aresetn] [get_bd_pins axi_tft/s_axi_aresetn]
connect_bd_net [get_bd_pins axi_tft/ip2intc_irpt] [get_bd_pins tft_intr]
connect_bd_net -net sysclk_hier_clk_10M [get_bd_pins tft_clk] [get_bd_pins axi_tft/sys_tft_clk]
connect_bd_net [get_bd_pins axi_timer_pwm/pwm0] [get_bd_pins tft_lcd_pwm]
connect_bd_net [get_bd_pins axi_timer_pwm/interrupt] [get_bd_pins pwm_intr]

current_bd_instance /clock_hier
connect_bd_intf_net [get_bd_intf_pins hmc1031] [get_bd_intf_pins hmc1031_0/HMC1031]
connect_bd_intf_net -intf_net periph_interconnect_hier_M02_AXI [get_bd_intf_pins S_AXI] [get_bd_intf_pins hmc1031_0/S_AXI]
connect_bd_intf_net -intf_net periph_interconnect_hier_M03_AXI [get_bd_intf_pins S_AXI1] [get_bd_intf_pins hmc1033_0/S_AXI]
connect_bd_intf_net [get_bd_intf_pins hmc1033] [get_bd_intf_pins hmc1033_0/hmc1033]
connect_bd_net -net mb_hier_peripheral_aresetn [get_bd_pins s_axi_aresetn] [get_bd_pins hmc1031_0/s_axi_aresetn] [get_bd_pins hmc1033_0/s_axi_aresetn]
connect_bd_net [get_bd_pins clk_wiz_0/clk_5M] [get_bd_pins glclk]
connect_bd_net -net microblaze_0_Clk [get_bd_pins s_axi_aclk] [get_bd_pins hmc1031_0/s_axi_aclk] [get_bd_pins hmc1033_0/s_axi_aclk]
connect_bd_net -net clk_in1_1 [get_bd_pins clk_in] [get_bd_pins clk_wiz_0/clk_in1]

current_bd_instance /adc_hier
connect_bd_intf_net -intf_net periph_interconnect_hier_M05_AXI [get_bd_intf_pins S_AXI_SYNC] [get_bd_intf_pins syncron_0/S_AXI]
connect_bd_intf_net -intf_net adc7_dq_0_1 [get_bd_intf_pins adc7_dq] [get_bd_intf_pins adc8_0/adc7_dq]
connect_bd_intf_net -intf_net adc6_dq_0_1 [get_bd_intf_pins adc6_dq] [get_bd_intf_pins adc8_0/adc6_dq]
connect_bd_intf_net -intf_net adc5_dq_0_1 [get_bd_intf_pins adc5_dq] [get_bd_intf_pins adc8_0/adc5_dq]
connect_bd_intf_net -intf_net adc3_dq_0_1 [get_bd_intf_pins adc3_dq] [get_bd_intf_pins adc8_0/adc3_dq]
connect_bd_intf_net -intf_net adc2_dq_0_1 [get_bd_intf_pins adc2_dq] [get_bd_intf_pins adc8_0/adc2_dq]
connect_bd_intf_net -intf_net adc1_dq_0_1 [get_bd_intf_pins adc1_dq] [get_bd_intf_pins adc8_0/adc1_dq]
connect_bd_intf_net [get_bd_intf_pins adc8] [get_bd_intf_pins adc8_0/adc8_intf]
connect_bd_intf_net -intf_net adc4_dq_0_1 [get_bd_intf_pins adc4_dq] [get_bd_intf_pins adc8_0/adc4_dq]
connect_bd_intf_net [get_bd_intf_pins axis_interconnect_0/S04_AXIS] [get_bd_intf_pins adc8_tcb_0/m4_axis]
connect_bd_intf_net [get_bd_intf_pins adc8_tcb_0/m1_axis] [get_bd_intf_pins axis_interconnect_0/S01_AXIS]
connect_bd_intf_net [get_bd_intf_pins adc8_tcb_0/m5_axis] [get_bd_intf_pins axis_interconnect_0/S05_AXIS]
connect_bd_intf_net [get_bd_intf_pins adc8_tcb_0/m0_axis] [get_bd_intf_pins axis_interconnect_0/S00_AXIS]
connect_bd_intf_net [get_bd_intf_pins axis_interconnect_0/S06_AXIS] [get_bd_intf_pins adc8_tcb_0/m6_axis]
connect_bd_intf_net [get_bd_intf_pins S_AXI_IC] [get_bd_intf_pins axis_interconnect_0/S_AXI_CTRL]
connect_bd_intf_net -intf_net periph_interconnect_hier_M04_AXI [get_bd_intf_pins S_AXI_ADC] [get_bd_intf_pins adc8_0/S_AXI]
connect_bd_intf_net [get_bd_intf_pins adc8_0/m0_axis] [get_bd_intf_pins adc8_tcb_0/s0_axis]
connect_bd_intf_net [get_bd_intf_pins adc8_0/m4_axis] [get_bd_intf_pins adc8_tcb_0/s4_axis]
connect_bd_intf_net [get_bd_intf_pins adc8_0/m5_axis] [get_bd_intf_pins adc8_tcb_0/s5_axis]
connect_bd_intf_net [get_bd_intf_pins adc8_0/m2_axis] [get_bd_intf_pins adc8_tcb_0/s2_axis]
connect_bd_intf_net [get_bd_intf_pins adc8_0/m7_axis] [get_bd_intf_pins adc8_tcb_0/s7_axis]
connect_bd_intf_net [get_bd_intf_pins adc8_0/m6_axis] [get_bd_intf_pins adc8_tcb_0/s6_axis]
connect_bd_intf_net [get_bd_intf_pins adc8_0/m1_axis] [get_bd_intf_pins adc8_tcb_0/s1_axis]
connect_bd_intf_net [get_bd_intf_pins adc8_0/m3_axis] [get_bd_intf_pins adc8_tcb_0/s3_axis]
connect_bd_intf_net [get_bd_intf_pins adc8_tcb_0/m3_axis] [get_bd_intf_pins axis_interconnect_0/S03_AXIS]
connect_bd_intf_net [get_bd_intf_pins axis_interconnect_0/S02_AXIS] [get_bd_intf_pins adc8_tcb_0/m2_axis]
connect_bd_intf_net [get_bd_intf_pins M_AXI_DMA] [get_bd_intf_pins axi_dma_0/M_AXI_S2MM]
connect_bd_intf_net -intf_net adc0_dq_0_1 [get_bd_intf_pins adc0_dq] [get_bd_intf_pins adc8_0/adc0_dq]
connect_bd_intf_net [get_bd_intf_pins S_AXI_TCB] [get_bd_intf_pins adc8_tcb_0/S_AXI]
connect_bd_intf_net [get_bd_intf_pins adc8_tcb_0/m7_axis] [get_bd_intf_pins axis_interconnect_0/S07_AXIS]
connect_bd_intf_net [get_bd_intf_pins axis_interconnect_0/M00_AXIS] [get_bd_intf_pins axi_dma_0/S_AXIS_S2MM]
connect_bd_intf_net [get_bd_intf_pins S_AXI_DMA] [get_bd_intf_pins axi_dma_0/S_AXI_LITE]
connect_bd_net [get_bd_pins syncron_0/csync] [get_bd_pins adc8_0/esync]
connect_bd_net [get_bd_pins xlconstant_0/dout] [get_bd_pins proc_sys_reset_0/ext_reset_in]
connect_bd_net [get_bd_pins proc_sys_reset_0/peripheral_aresetn] \
  [get_bd_pins axis_interconnect_0/S00_AXIS_ARESETN] [get_bd_pins axis_interconnect_0/ARESETN] \
  [get_bd_pins axis_interconnect_0/S01_AXIS_ARESETN] [get_bd_pins axis_interconnect_0/S02_AXIS_ARESETN] \
  [get_bd_pins axis_interconnect_0/S03_AXIS_ARESETN] [get_bd_pins axis_interconnect_0/S04_AXIS_ARESETN] \
  [get_bd_pins axis_interconnect_0/S05_AXIS_ARESETN] [get_bd_pins axis_interconnect_0/S06_AXIS_ARESETN] \
  [get_bd_pins axis_interconnect_0/S07_AXIS_ARESETN] [get_bd_pins adc8_tcb_0/aresetn] [get_bd_pins adc8_0/aresetn]
connect_bd_net -net sysclk_hier_clk_in [get_bd_pins clk_in] \
  [get_bd_pins proc_sys_reset_0/slowest_sync_clk] [get_bd_pins syncron_0/syn_clk] \
  [get_bd_pins axis_interconnect_0/S00_AXIS_ACLK] [get_bd_pins axis_interconnect_0/ACLK] \
  [get_bd_pins axis_interconnect_0/S01_AXIS_ACLK] [get_bd_pins axis_interconnect_0/S02_AXIS_ACLK] \
  [get_bd_pins axis_interconnect_0/S03_AXIS_ACLK] [get_bd_pins axis_interconnect_0/S04_AXIS_ACLK] \
  [get_bd_pins axis_interconnect_0/S05_AXIS_ACLK] [get_bd_pins axis_interconnect_0/S06_AXIS_ACLK] \
  [get_bd_pins axis_interconnect_0/S07_AXIS_ACLK] [get_bd_pins syncron_0/syn_clk_div] [get_bd_pins adc8_tcb_0/aclk] \
  [get_bd_pins adc8_0/aclk]
connect_bd_net -net microblaze_0_Clk [get_bd_pins s_axi_aclk] \
  [get_bd_pins syncron_0/s_axi_aclk] [get_bd_pins axi_dma_0/s_axi_lite_aclk] [get_bd_pins axi_dma_0/m_axi_s2mm_aclk] \
  [get_bd_pins axis_interconnect_0/M00_AXIS_ACLK] [get_bd_pins axis_interconnect_0/S_AXI_CTRL_ACLK] \
  [get_bd_pins adc8_tcb_0/s_axi_aclk] [get_bd_pins adc8_0/s_axi_aclk]
connect_bd_net -net mb_hier_peripheral_aresetn [get_bd_pins s_axi_aresetn] \
  [get_bd_pins syncron_0/s_axi_aresetn] [get_bd_pins axi_dma_0/axi_resetn] [get_bd_pins axis_interconnect_0/M00_AXIS_ARESETN] \
  [get_bd_pins axis_interconnect_0/S_AXI_CTRL_ARESETN] [get_bd_pins adc8_tcb_0/s_axi_aresetn] \
  [get_bd_pins adc8_0/s_axi_aresetn]
connect_bd_net -net clk_ref_1 [get_bd_pins ref_clk] [get_bd_pins adc8_0/ref_clk]
connect_bd_net -net microblaze_0_clk_wiz_1_locked [get_bd_pins dcm_locked] [get_bd_pins proc_sys_reset_0/dcm_locked]
connect_bd_net [get_bd_pins axi_dma_0/s2mm_introut] [get_bd_pins dma_intr]
connect_bd_net -net S00_ARB_REQ_SUPPRESS_1 [get_bd_pins xlconstant_1/dout] \
  [get_bd_pins axis_interconnect_0/S00_ARB_REQ_SUPPRESS] [get_bd_pins axis_interconnect_0/S01_ARB_REQ_SUPPRESS] \
  [get_bd_pins axis_interconnect_0/S02_ARB_REQ_SUPPRESS] [get_bd_pins axis_interconnect_0/S03_ARB_REQ_SUPPRESS] \
  [get_bd_pins axis_interconnect_0/S04_ARB_REQ_SUPPRESS] [get_bd_pins axis_interconnect_0/S05_ARB_REQ_SUPPRESS] \
  [get_bd_pins axis_interconnect_0/S06_ARB_REQ_SUPPRESS] [get_bd_pins axis_interconnect_0/S07_ARB_REQ_SUPPRESS]

current_bd_instance /fft_hier
connect_bd_intf_net -intf_net periph_interconnect_hier_M10_AXI [get_bd_intf_pins S_AXI] [get_bd_intf_pins axi_dma_0/S_AXI_LITE]
connect_bd_intf_net [get_bd_intf_pins xfft_0/M_AXIS_DATA] [get_bd_intf_pins axis_dwidth_converter_1/S_AXIS]
connect_bd_intf_net [get_bd_intf_pins axis_dwidth_converter_0/S_AXIS] [get_bd_intf_pins axi_dma_0/M_AXIS_MM2S]
connect_bd_intf_net [get_bd_intf_pins axis_dwidth_converter_0/M_AXIS] [get_bd_intf_pins xfft_0/S_AXIS_DATA]
connect_bd_intf_net [get_bd_intf_pins axis_dwidth_converter_1/M_AXIS] [get_bd_intf_pins axi_dma_0/S_AXIS_S2MM]
connect_bd_intf_net [get_bd_intf_pins M_AXI_MM2S_DMA] [get_bd_intf_pins axi_dma_0/M_AXI_MM2S]
connect_bd_intf_net [get_bd_intf_pins M_AXI_S2MM_DMA] [get_bd_intf_pins axi_dma_0/M_AXI_S2MM]
connect_bd_net [get_bd_pins xlconstant_0/dout] [get_bd_pins xfft_0/s_axis_config_tdata]
connect_bd_net [get_bd_pins xlconstant_1/dout] [get_bd_pins xfft_0/s_axis_config_tvalid]
connect_bd_net -net microblaze_0_Clk [get_bd_pins aclk] \
  [get_bd_pins axi_dma_0/m_axi_mm2s_aclk] [get_bd_pins axi_dma_0/m_axi_s2mm_aclk] [get_bd_pins xfft_0/aclk] \
  [get_bd_pins axis_dwidth_converter_1/aclk] [get_bd_pins axis_dwidth_converter_0/aclk] \
  [get_bd_pins axi_dma_0/s_axi_lite_aclk]
connect_bd_net -net mb_hier_peripheral_aresetn [get_bd_pins aresetn] \
  [get_bd_pins axis_dwidth_converter_1/aresetn] [get_bd_pins axis_dwidth_converter_0/aresetn] \
  [get_bd_pins axi_dma_0/axi_resetn]
connect_bd_net [get_bd_pins axi_dma_0/mm2s_introut] [get_bd_pins mm2s_intr]
connect_bd_net [get_bd_pins axi_dma_0/s2mm_introut] [get_bd_pins s2mm_intr]

current_bd_instance /
connect_bd_intf_net [get_bd_intf_pins adc_hier/S_AXI_ADC] [get_bd_intf_pins periph_interconnect_hier/M04_AXI]
connect_bd_intf_net -intf_net adc0_dq_0_1 [get_bd_intf_ports adc0_dq] [get_bd_intf_pins adc_hier/adc0_dq]
connect_bd_intf_net [get_bd_intf_pins mb_hier/M_AXI_PERIPH] [get_bd_intf_pins periph_interconnect_hier/S_AXI]
connect_bd_intf_net -intf_net mb_hier_M_AXI [get_bd_intf_pins mb_hier/M_AXI_DC] [get_bd_intf_pins ddr3_hier/S00_AXI]
connect_bd_intf_net -intf_net periph_interconnect_M01_AXI [get_bd_intf_pins tft_hier/S_AXI_PWM] [get_bd_intf_pins periph_interconnect_hier/M01_AXI]
connect_bd_intf_net -intf_net periph_interconnect_M00_AXI [get_bd_intf_pins tft_hier/S_AXI_TFT] [get_bd_intf_pins periph_interconnect_hier/M00_AXI]
connect_bd_intf_net -intf_net axi_tft_M_AXI_MM [get_bd_intf_pins tft_hier/M_AXI_TFT] [get_bd_intf_pins ddr3_hier/S01_AXI]
connect_bd_intf_net -intf_net axi_tft_VGA_INTF [get_bd_intf_ports tft_lcd] [get_bd_intf_pins tft_hier/tft_lcd]
connect_bd_intf_net -intf_net axi_dma_0_M_AXI_MM2S [get_bd_intf_pins fft_hier/M_AXI_MM2S_DMA] [get_bd_intf_pins ddr3_hier/S03_AXI]
connect_bd_intf_net -intf_net axi_dma_0_M_AXI_S2MM [get_bd_intf_pins fft_hier/M_AXI_S2MM_DMA] [get_bd_intf_pins ddr3_hier/S04_AXI]
connect_bd_intf_net -intf_net adc8_0_adc8_intf [get_bd_intf_ports adc8] [get_bd_intf_pins adc_hier/adc8]
connect_bd_intf_net -intf_net adc6_dq_0_1 [get_bd_intf_ports adc6_dq] [get_bd_intf_pins adc_hier/adc6_dq]
connect_bd_intf_net -intf_net hmc1031_0_HMC1031 [get_bd_intf_ports hmc1031] [get_bd_intf_pins clock_hier/hmc1031]
connect_bd_intf_net [get_bd_intf_pins clock_hier/S_AXI] [get_bd_intf_pins periph_interconnect_hier/M02_AXI]
connect_bd_intf_net [get_bd_intf_pins clock_hier/S_AXI1] [get_bd_intf_pins periph_interconnect_hier/M03_AXI]
connect_bd_intf_net -intf_net mig_7series_0_DDR3 [get_bd_intf_ports DDR3] [get_bd_intf_pins ddr3_hier/DDR3]
connect_bd_intf_net -intf_net adc7_dq_0_1 [get_bd_intf_ports adc7_dq] [get_bd_intf_pins adc_hier/adc7_dq]
connect_bd_intf_net [get_bd_intf_pins periph_interconnect_hier/M06_AXI] [get_bd_intf_pins adc_hier/S_AXI_TCB]
connect_bd_intf_net [get_bd_intf_pins periph_interconnect_hier/M07_AXI] [get_bd_intf_pins adc_hier/S_AXI_DMA]
connect_bd_intf_net -intf_net adc4_dq_0_1 [get_bd_intf_ports adc4_dq] [get_bd_intf_pins adc_hier/adc4_dq]
connect_bd_intf_net -intf_net adc2_dq_0_1 [get_bd_intf_ports adc2_dq] [get_bd_intf_pins adc_hier/adc2_dq]
connect_bd_intf_net -intf_net adc5_dq_0_1 [get_bd_intf_ports adc5_dq] [get_bd_intf_pins adc_hier/adc5_dq]
connect_bd_intf_net [get_bd_intf_pins adc_hier/S_AXI_SYNC] [get_bd_intf_pins periph_interconnect_hier/M05_AXI]
connect_bd_intf_net -intf_net adc_hier_M_AXI_S2MM [get_bd_intf_pins adc_hier/M_AXI_DMA] [get_bd_intf_pins ddr3_hier/S02_AXI]
connect_bd_intf_net [get_bd_intf_pins periph_interconnect_hier/M08_AXI] [get_bd_intf_pins adc_hier/S_AXI_IC]
connect_bd_intf_net [get_bd_intf_pins axi_gpio_usr/S_AXI] [get_bd_intf_pins periph_interconnect_hier/M09_AXI]
connect_bd_intf_net [get_bd_intf_pins fft_hier/S_AXI] [get_bd_intf_pins periph_interconnect_hier/M10_AXI]
connect_bd_intf_net -intf_net hmc1033_0_hmc1033 [get_bd_intf_ports hmc1033] [get_bd_intf_pins clock_hier/hmc1033]
connect_bd_intf_net -intf_net adc3_dq_0_1 [get_bd_intf_ports adc3_dq] [get_bd_intf_pins adc_hier/adc3_dq]
connect_bd_intf_net -intf_net adc1_dq_0_1 [get_bd_intf_ports adc1_dq] [get_bd_intf_pins adc_hier/adc1_dq]
connect_bd_net -net microblaze_0_Clk [get_bd_pins sysclk_hier/clk_100M] \
  [get_bd_pins mb_hier/clk] [get_bd_pins ddr3_hier/aclk] [get_bd_pins periph_interconnect_hier/S_ACLK] \
  [get_bd_pins tft_hier/aclk] [get_bd_pins vio_usr/clk] [get_bd_pins clock_hier/s_axi_aclk] [get_bd_pins adc_hier/s_axi_aclk] \
  [get_bd_pins axi_gpio_usr/s_axi_aclk] [get_bd_pins fft_hier/aclk]
connect_bd_net -net microblaze_0_clk_wiz_1_locked [get_bd_pins sysclk_hier/locked] [get_bd_pins mb_hier/dcm_locked] [get_bd_pins adc_hier/dcm_locked]
connect_bd_net [get_bd_ports sys_clk_p] [get_bd_pins sysclk_hier/sys_clk_p]
connect_bd_net [get_bd_ports sys_clk_n] [get_bd_pins sysclk_hier/sys_clk_n]
connect_bd_net -net clk_ref_1 [get_bd_pins sysclk_hier/clk_200M] [get_bd_pins ddr3_hier/clk_ref] [get_bd_pins adc_hier/ref_clk]
connect_bd_net [get_bd_pins mb_hier/peripheral_aresetn] \
  [get_bd_pins ddr3_hier/aresetn] [get_bd_pins periph_interconnect_hier/S_ARESETN] [get_bd_pins tft_hier/aresetn] \
  [get_bd_pins clock_hier/s_axi_aresetn] [get_bd_pins adc_hier/s_axi_aresetn] [get_bd_pins axi_gpio_usr/s_axi_aresetn] \
  [get_bd_pins fft_hier/aresetn]
connect_bd_net [get_bd_pins sysclk_hier/clk_10M] [get_bd_pins tft_hier/tft_clk]
connect_bd_net [get_bd_pins xlconcat_0/dout] [get_bd_pins mb_hier/intr]
connect_bd_net -net axi_tft_ip2intc_irpt [get_bd_pins tft_hier/tft_intr] [get_bd_pins xlconcat_0/In0]
connect_bd_net -net axi_timer_pwm_interrupt [get_bd_pins tft_hier/pwm_intr] [get_bd_pins xlconcat_0/In1]
connect_bd_net -net axi_timer_pwm_pwm0 [get_bd_pins tft_hier/tft_lcd_pwm] [get_bd_ports tft_lcd_pwm]
connect_bd_net -net probe_in1_0_1 [get_bd_ports usr_sw] [get_bd_pins vio_usr/probe_in1] [get_bd_pins axi_gpio_usr/gpio2_io_i]
connect_bd_net -net clock_hier_clk_5M_0 [get_bd_pins clock_hier/glclk] [get_bd_ports glclk]
connect_bd_net -net sysclk_hier_clk_in [get_bd_pins sysclk_hier/clk_125M] \
  [get_bd_ports clk_in] [get_bd_pins clock_hier/clk_in] [get_bd_pins adc_hier/clk_in]
connect_bd_net [get_bd_pins vio_usr/probe_out0] [get_bd_ports usr_led_a]
connect_bd_net [get_bd_pins vio_usr/probe_out1] [get_bd_ports usr_led_b]
connect_bd_net [get_bd_pins adc_hier/dma_intr] [get_bd_pins xlconcat_0/In2]
connect_bd_net -net probe_in0_0_1 [get_bd_ports usr_btn] [get_bd_pins vio_usr/probe_in0] [get_bd_pins axi_gpio_usr/gpio_io_i]
connect_bd_net [get_bd_pins axi_gpio_usr/ip2intc_irpt] [get_bd_pins xlconcat_0/In3]
connect_bd_net -net axi_dma_0_mm2s_introut [get_bd_pins fft_hier/mm2s_intr] [get_bd_pins xlconcat_0/In4]
connect_bd_net -net axi_dma_0_s2mm_introut [get_bd_pins fft_hier/s2mm_intr] [get_bd_pins xlconcat_0/In5]

# ---- address map ----
assign_bd_address -offset 0x80000000 -range 1G -target_address_space [get_bd_addr_spaces adc_hier/axi_dma_0/Data_S2MM] [get_bd_addr_segs ddr3_hier/mig_7series_0/memmap/memaddr]
assign_bd_address -offset 0x80000000 -range 1G -target_address_space [get_bd_addr_spaces fft_hier/axi_dma_0/Data_MM2S] [get_bd_addr_segs ddr3_hier/mig_7series_0/memmap/memaddr]
assign_bd_address -offset 0x80000000 -range 1G -target_address_space [get_bd_addr_spaces fft_hier/axi_dma_0/Data_S2MM] [get_bd_addr_segs ddr3_hier/mig_7series_0/memmap/memaddr]
assign_bd_address -offset 0x00000000 -range 512K -target_address_space [get_bd_addr_spaces mb_hier/microblaze_0/Data] [get_bd_addr_segs mb_hier/microblaze_0_local_memory/dlmb_bram_if_cntlr/SLMB/Mem]
assign_bd_address -offset 0x40000000 -range 64K -target_address_space [get_bd_addr_spaces mb_hier/microblaze_0/Data] [get_bd_addr_segs axi_gpio_usr/S_AXI/Reg]
assign_bd_address -offset 0x41200000 -range 64K -target_address_space [get_bd_addr_spaces mb_hier/microblaze_0/Data] [get_bd_addr_segs mb_hier/microblaze_0_axi_intc/S_AXI/Reg]
assign_bd_address -offset 0x41400000 -range 4K -target_address_space [get_bd_addr_spaces mb_hier/microblaze_0/Data] [get_bd_addr_segs mb_hier/mdm_1/S_AXI/Reg]
assign_bd_address -offset 0x41C00000 -range 64K -target_address_space [get_bd_addr_spaces mb_hier/microblaze_0/Data] [get_bd_addr_segs mb_hier/axi_timer_0/S_AXI/Reg]
assign_bd_address -offset 0x41C10000 -range 64K -target_address_space [get_bd_addr_spaces mb_hier/microblaze_0/Data] [get_bd_addr_segs tft_hier/axi_timer_pwm/S_AXI/Reg]
assign_bd_address -offset 0x41E00000 -range 64K -target_address_space [get_bd_addr_spaces mb_hier/microblaze_0/Data] [get_bd_addr_segs adc_hier/axi_dma_0/S_AXI_LITE/Reg]
assign_bd_address -offset 0x41E10000 -range 64K -target_address_space [get_bd_addr_spaces mb_hier/microblaze_0/Data] [get_bd_addr_segs fft_hier/axi_dma_0/S_AXI_LITE/Reg]
assign_bd_address -offset 0x44A00000 -range 64K -target_address_space [get_bd_addr_spaces mb_hier/microblaze_0/Data] [get_bd_addr_segs tft_hier/axi_tft/S_AXI_MM/Reg]
assign_bd_address -offset 0x44A10000 -range 64K -target_address_space [get_bd_addr_spaces mb_hier/microblaze_0/Data] [get_bd_addr_segs clock_hier/hmc1031_0/S_AXI/S_AXI_reg]
assign_bd_address -offset 0x44A20000 -range 64K -target_address_space [get_bd_addr_spaces mb_hier/microblaze_0/Data] [get_bd_addr_segs clock_hier/hmc1033_0/S_AXI/S_AXI_reg]
assign_bd_address -offset 0x44A30000 -range 64K -target_address_space [get_bd_addr_spaces mb_hier/microblaze_0/Data] [get_bd_addr_segs adc_hier/adc8_0/S_AXI/S_AXI_reg]
assign_bd_address -offset 0x44A40000 -range 64K -target_address_space [get_bd_addr_spaces mb_hier/microblaze_0/Data] [get_bd_addr_segs adc_hier/syncron_0/S_AXI/S_AXI_reg]
assign_bd_address -offset 0x44A50000 -range 64K -target_address_space [get_bd_addr_spaces mb_hier/microblaze_0/Data] [get_bd_addr_segs adc_hier/adc8_tcb_0/S_AXI/S_AXI_reg]
assign_bd_address -offset 0x44A60000 -range 64K -target_address_space [get_bd_addr_spaces mb_hier/microblaze_0/Data] [get_bd_addr_segs adc_hier/axis_interconnect_0/xbar/S_AXI_CTRL/Reg]
assign_bd_address -offset 0x80000000 -range 1G -target_address_space [get_bd_addr_spaces mb_hier/microblaze_0/Data] [get_bd_addr_segs ddr3_hier/mig_7series_0/memmap/memaddr]
assign_bd_address -offset 0x00000000 -range 512K -target_address_space [get_bd_addr_spaces mb_hier/microblaze_0/Instruction] [get_bd_addr_segs mb_hier/microblaze_0_local_memory/ilmb_bram_if_cntlr/SLMB/Mem]
assign_bd_address -offset 0x80000000 -range 1G -target_address_space [get_bd_addr_spaces tft_hier/axi_tft/Video_data] [get_bd_addr_segs ddr3_hier/mig_7series_0/memmap/memaddr]

validate_bd_design
save_bd_design
